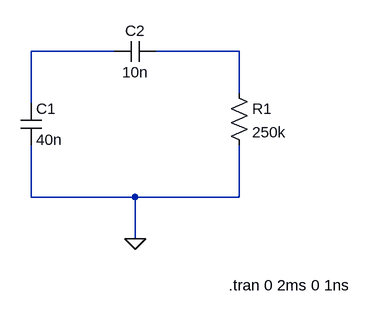
[diagram p0: schematic Draft2.asc]
Draft2.asc, the LTspice schematic file:
Version 4
SHEET 1 880 680
WIRE 352 192 224 192
WIRE 544 192 416 192
WIRE 544 256 544 192
WIRE 224 272 224 192
WIRE 224 416 224 336
WIRE 384 416 224 416
WIRE 544 416 544 336
WIRE 544 416 384 416
WIRE 384 480 384 416
FLAG 384 480 0
SYMBOL cap 208 272 R0
SYMATTR InstName C1
SYMATTR Value 40n
SYMBOL cap 352 208 R270
WINDOW 0 32 32 VTop 2
WINDOW 3 0 32 VBottom 2
SYMATTR InstName C2
SYMATTR Value 10n
SYMBOL res 528 240 R0
SYMATTR InstName R1
SYMATTR Value 250k
TEXT 528 552 Left 2 !.tran 0 2ms 0 1ns

The netlist it stands for:
* Draft2.asc
C1 N001 0 40n
C2 N001 N002 10n
R1 N002 0 250k
.tran 0 2ms 0 1ns
.backanno
.end